# EAGLE design v1 (EAGLE 6.6.0)
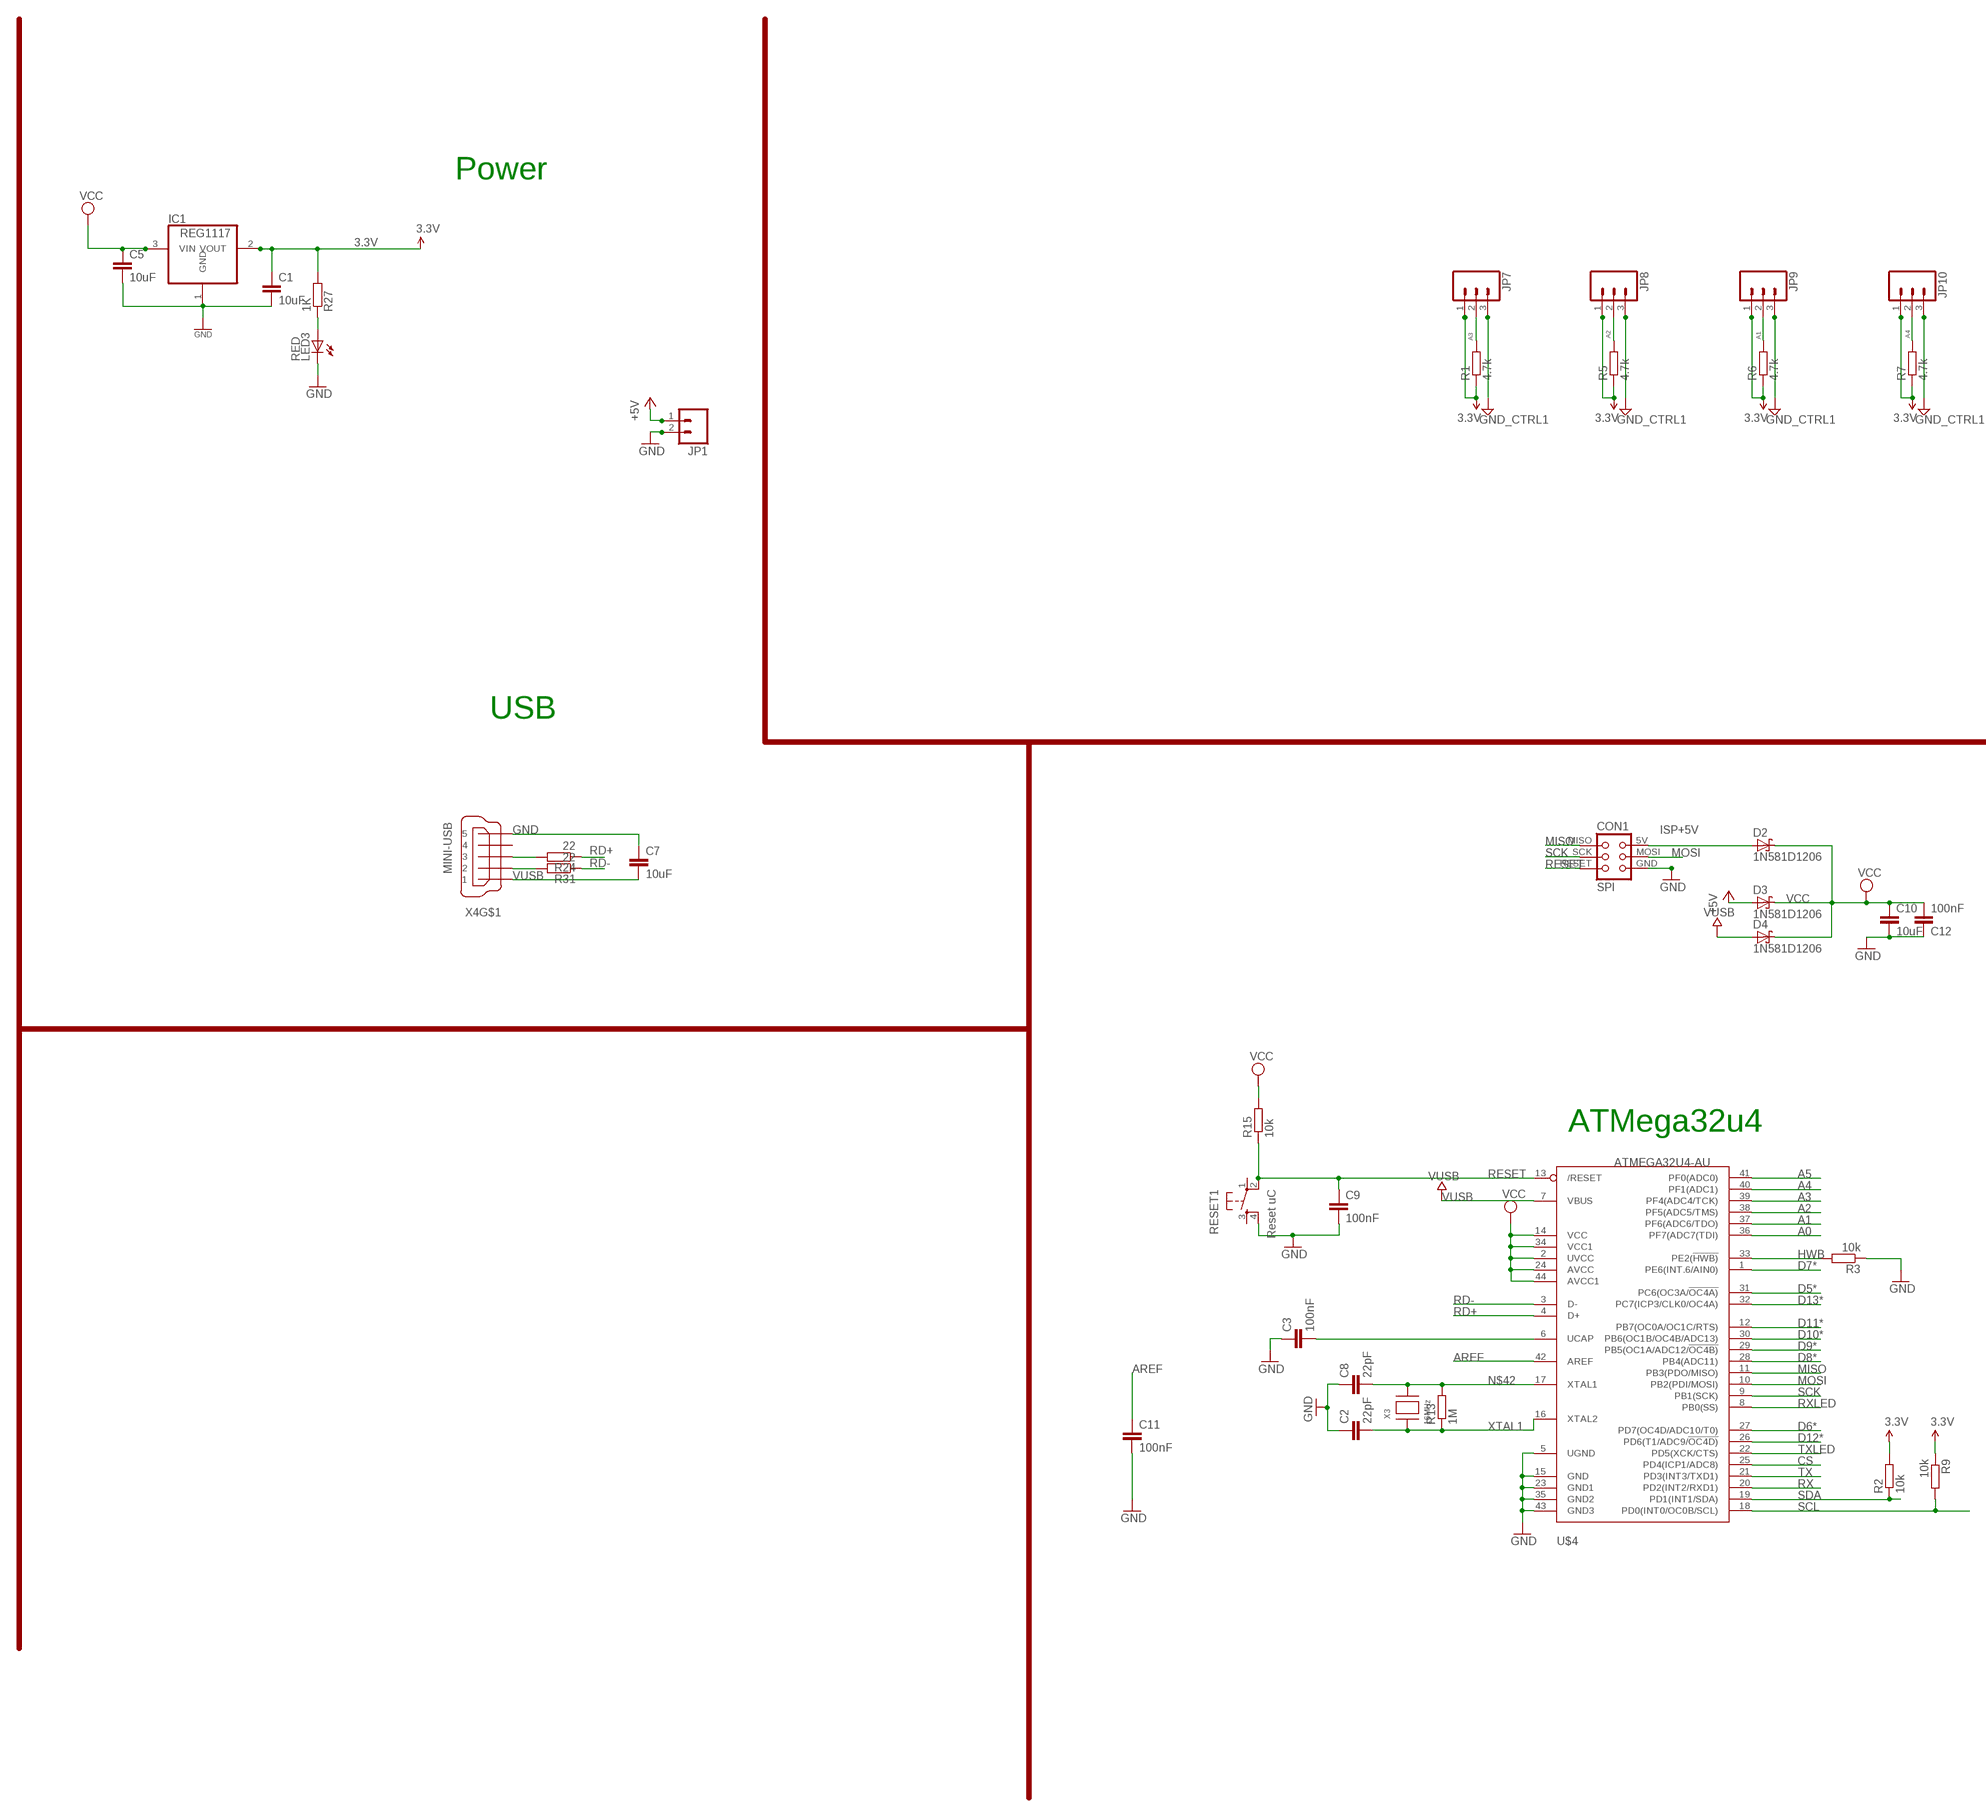
[diagram p0: schematic, sheet 1, part 1 of 2]
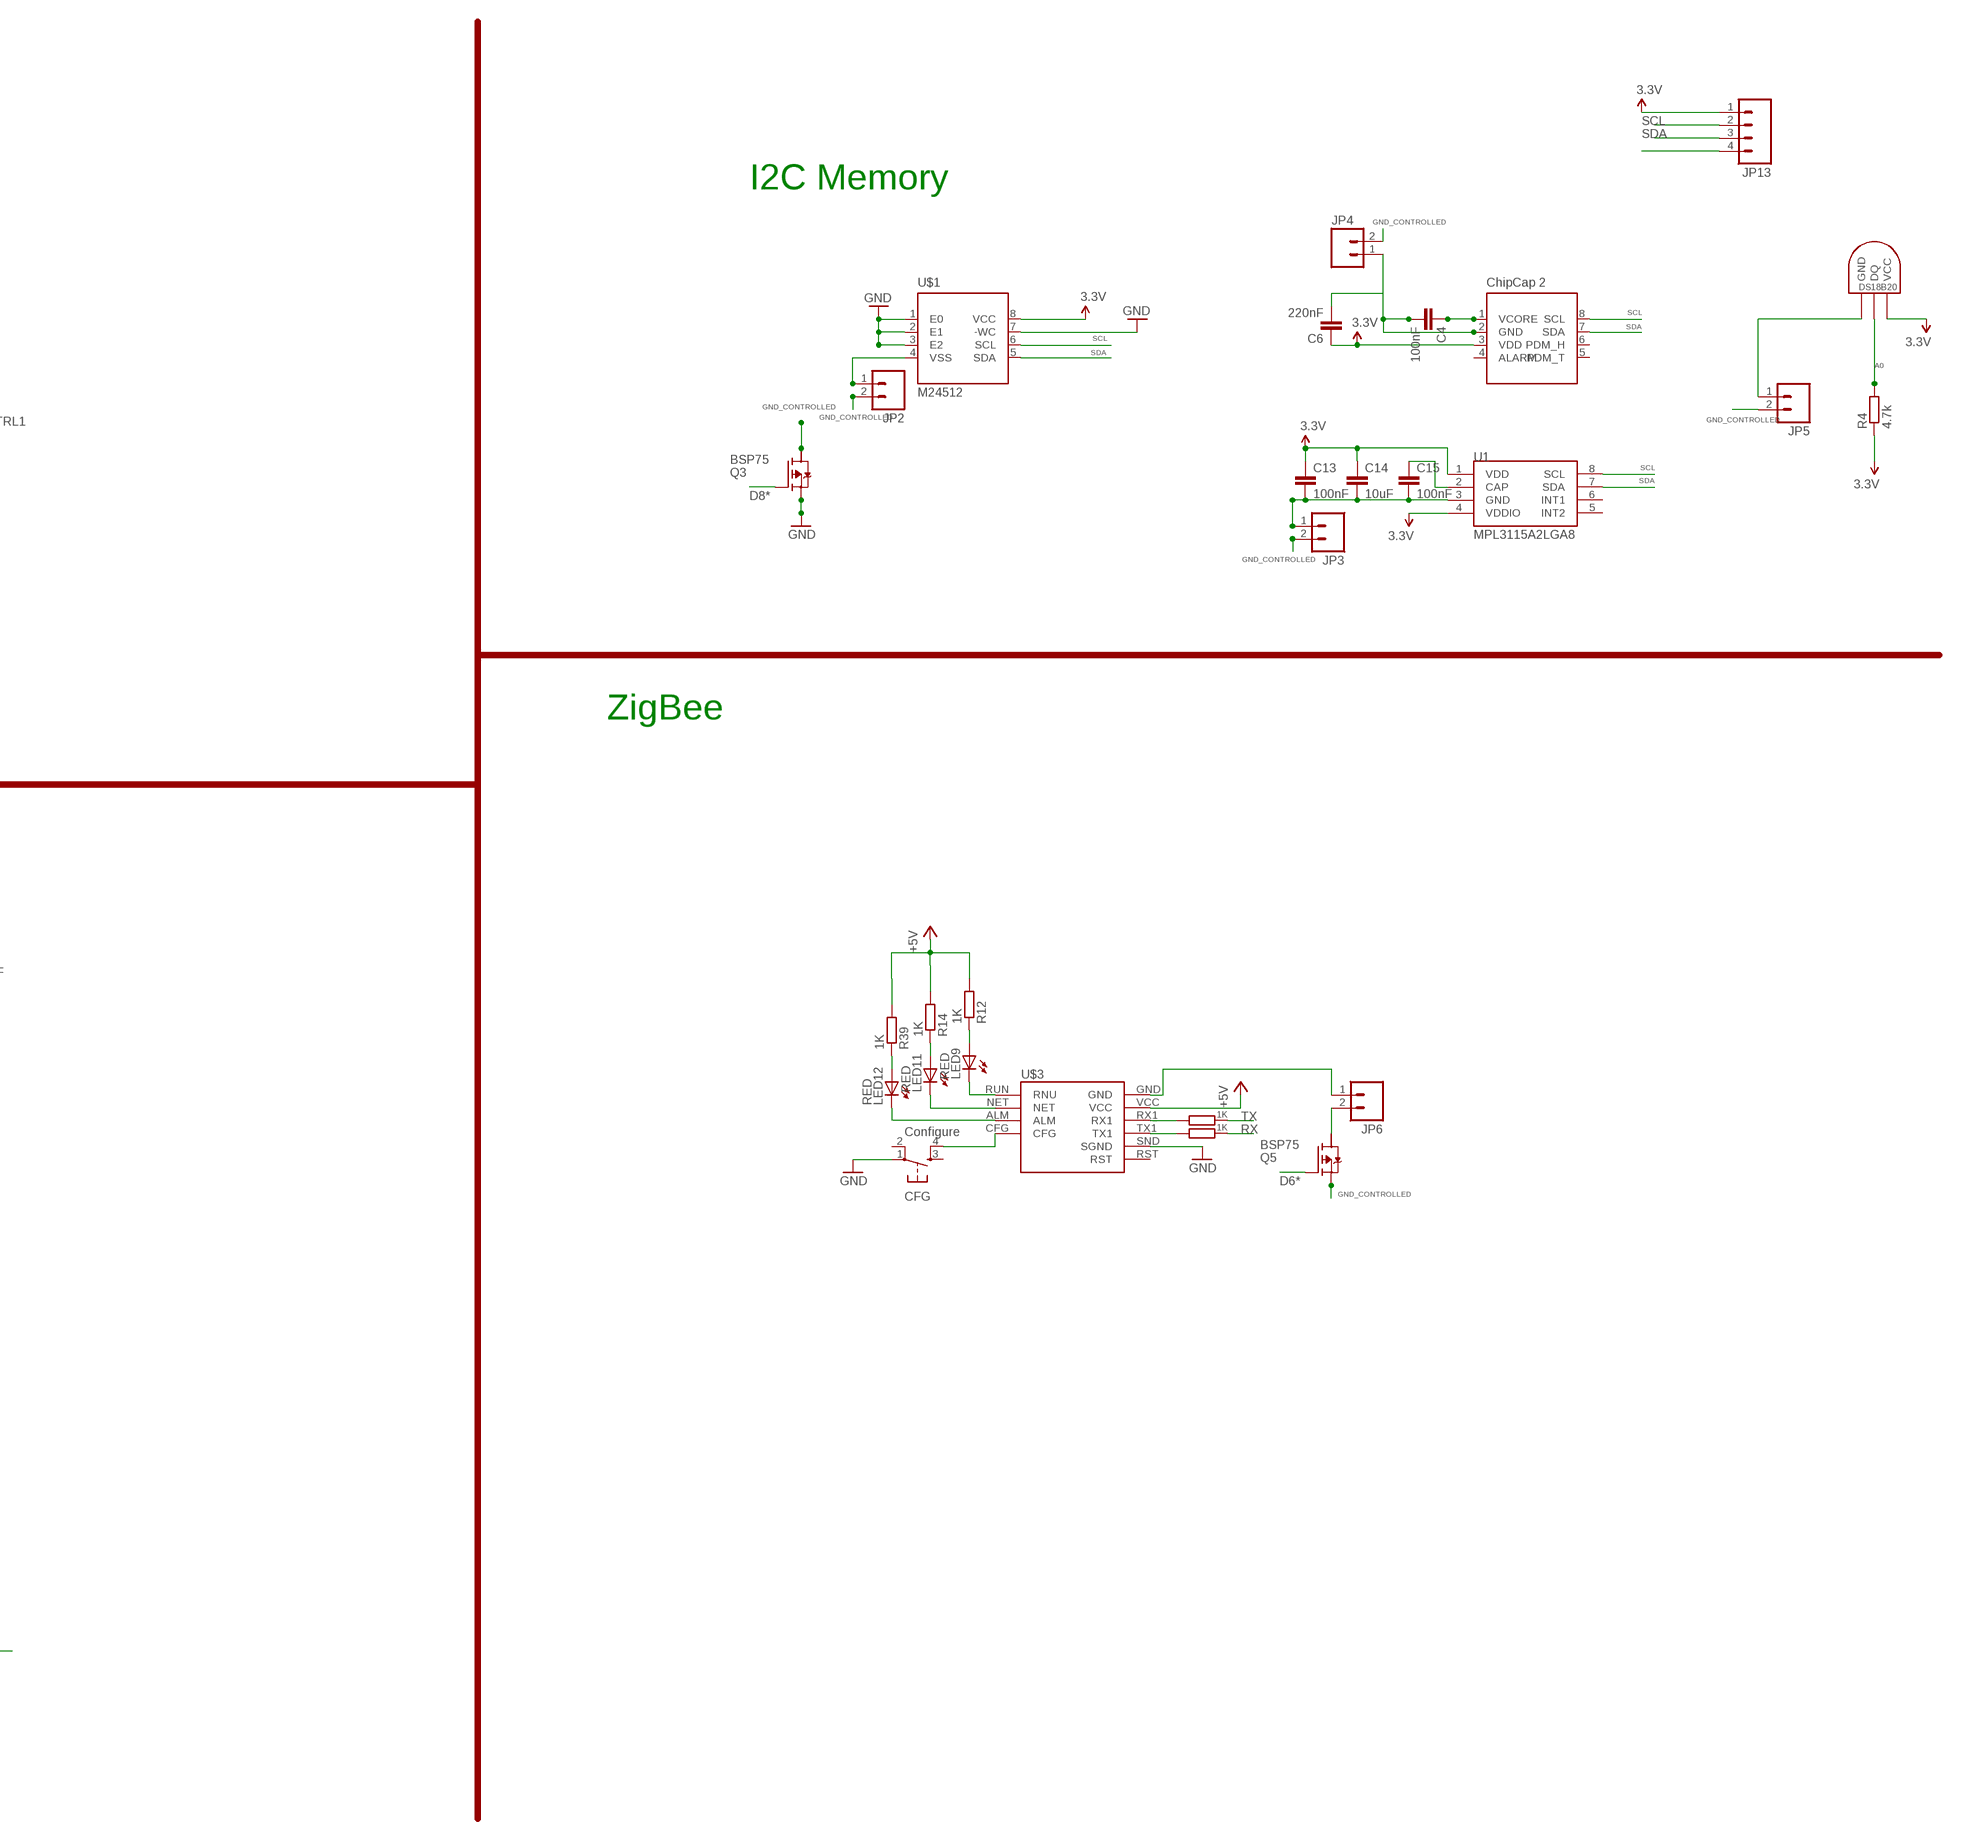
[diagram p1: schematic, sheet 1, part 2 of 2]

## Parts
C1  10uF  C-EUC1206  [C1206]
C2  22pF  C-EUC1206  [C1206]
C3  100nF  C-EUC1206  [C1206]
C4  100nF  C-EUC1206  [C1206]
C5  10uF  C-EUC1206  [C1206]
C6  220nF  C-EUC1206  [C1206]
C7  10uF  C-EUC1206  [C1206]
C8  22pF  C-EUC1206  [C1206]
C9  100nF  C-EUC1206  [C1206]
C10  10uF  C-EUC1206  [C1206]
C11  100nF  C-EUC1206  [C1206]
C12  100nF  C-EUC1206  [C1206]
C13  100nF  C-EUC1206  [C1206]
C14  10uF  C-EUC1206  [C1206]
C15  100nF  C-EUC1206  [C1206]
CFG  Configure  TAC_SWITCHSMD  [TACTILE_SWITCH_SMD]
CON1  SPI  TINYISPT  [TC2030-MCP-NL]
D2  1N581D1206  [LED-1206]
D3  1N581D1206  [LED-1206]
D4  1N581D1206  [LED-1206]
IC1  REG1117  [SOT223]
JP1  M02LOCK_LONGPADS  [1X02_LOCK_LONGPADS]
JP2  M02LOCK_LONGPADS  [1X02_LOCK_LONGPADS]
JP3  M02LOCK_LONGPADS  [1X02_LOCK_LONGPADS]
JP4  M02LOCK_LONGPADS  [1X02_LOCK_LONGPADS]
JP5  M02LOCK_LONGPADS  [1X02_LOCK_LONGPADS]
JP6  M02LOCK_LONGPADS  [1X02_LOCK_LONGPADS]
JP7  M03LONGPADS  [1X03_LONGPADS]
JP8  M03LONGPADS  [1X03_LONGPADS]
JP9  M03LONGPADS  [1X03_LONGPADS]
JP10  M03LONGPADS  [1X03_LONGPADS]
JP13  M04LOCK_LONGPADS  [1X04_LOCK_LONGPADS]
LED3  RED  LEDCHIP-LED0805  [CHIP-LED0805]
LED9  RED  LEDCHIP-LED0805  [CHIP-LED0805]
LED11  RED  LEDCHIP-LED0805  [CHIP-LED0805]
LED12  RED  LEDCHIP-LED0805  [CHIP-LED0805]
Q3  BSP75  BSP613P  [PG-SOT-223]
Q5  BSP75  BSP613P  [PG-SOT-223]
R1  4.7k  R-EU_M1206  [M1206]
R2  10k  R-EU_M1206  [M1206]
R3  10k  R-EU_M0805  [M0805]
R4  4.7k  R-EU_M1206  [M1206]
R5  4.7k  R-EU_M1206  [M1206]
R6  4.7k  R-EU_M1206  [M1206]
R7  4.7k  R-EU_M1206  [M1206]
R8  1K  R-EU_R0805  [R0805]
R9  10k  R-EU_M1206  [M1206]
R11  1K  R-EU_R0805  [R0805]
R12  1K  R-EU_R0805  [R0805]
R13  1M  R-EU_R1206  [R1206]
R14  1K  R-EU_R0805  [R0805]
R15  10k  R-EU_M0805  [M0805]
R24  22  R-EU_M1206  [M1206]
R27  1K  R-EU_R0805  [R0805]
R31  22  R-EU_M1206  [M1206]
R39  1K  R-EU_R0805  [R0805]
RESET1  Reset uC  TAC_SWITCHSMD  [TACTILE_SWITCH_SMD]
U1  MPL3115A2LGA8  [LGA8]
U$1  M24512  [SO8]
U$2  CHIPCAP  [CHIPCAP]
U$3  SZ05-ZIGBEETHROUGHHOLE  [SZ05-ZIGBEE4]
U$4  ATMEGA32U4-AU  [TQFP44]
U$6  DS1820  [µSOP8]
X3  16MHz  XTALNX6035  [NX6035]
X4  MINI-USB  MINI-USB-SCHIELD-32005-201  [32005-201]

## Nets
3.3V [power]: C1.1 C6.1 C13.1 C14.1 IC1.2(VOUT) JP7.1 JP8.1 JP9.1 JP10.1 JP13.1 R1.1 R2.2 R4.1 R5.1 R6.1 R7.1 R9.1 R27.2 U1.1(VDD) U1.4(VDDIO) U$1.8(VCC) U$2.3(VDD) U$6.8(VCC)
$1: C13.2 C14.2 C15.2 JP3.1 U1.3(GND)
$2: C4.2 C6.2 JP4.1 U$2.2(GND)
$3: JP5.1 U$6.4(GND)
$12: JP2.1 U$1.4(VSS)
+5V [power]: D3.A JP1.1 R12.2 R14.2 R39.2 U$3.VCC
A0: R4.2 U$4.36(PF7(ADC7(TDI)) U$6.1(DQ)
A1: JP9.2 R6.2 U$4.37(PF6(ADC6/TDO))
A2: JP8.2 R5.2 U$4.38(PF5(ADC5/TMS))
A3: JP7.2 R1.2 U$4.39(PF4(ADC4/TCK))
A4: JP10.2 R7.2 U$4.40(PF1(ADC1))
A5: U$4.41(PF0(ADC0))
AREF: C11.1 U$4.42(AREF)
CS: U$4.25(PD4(ICP1/ADC8))
D5*: U$4.31(PC6(OC3A/!OC4A))
D6*: Q5.1(G) U$4.27(PD7(OC4D/ADC10/T0))
D7*: U$4.1(PE6(INT.6/AIN0))
D8*: Q3.1(G) U$4.28(PB4(ADC11))
D9*: U$4.29(PB5(OC1A/ADC12/!OC4B))
D10*: U$4.30(PB6(OC1B/OC4B/ADC13))
D11*: U$4.12(PB7(OC0A/OC1C/RTS))
D12*: U$4.26(PD6(T1/ADC9/!OC4D))
D13*: U$4.32(PC7(ICP3/CLK0/OC4A))
D+USB: R24.2 X4.3
D-USB: R31.2 X4.2
GND [power]: C1.2 C2.1 C3.1 C5.2 C7.1 C8.1 C9.2 C10.2 C11.2 C12.1 CFG.1 CON1.GND IC1.1(GND) JP1.2 JP7.3 JP8.3 JP9.3 JP10.3 LED3.C Q3.3(S) R3.1 RESET1.4 U$1.1(E0) U$1.2(E1) U$1.3(E2) U$1.7(-WC) U$3.SND(SGND) U$4.5(UGND) U$4.15(GND) U$4.23(GND1) U$4.35(GND2) U$4.43(GND3) X4.5 ; supply symbol labelled GND_CTRL1
GND1 [VIN]: LED9.C U$3.RUN(RNU)
GND2 [VIN]: LED11.C U$3.NET
GND3 [VIN]: LED12.C U$3.ALM
GND_CONTROLLED [power]: JP2.2 JP3.2 JP4.2 JP5.2 JP13.4 Q3.2(D) Q5.3(S)
HWB: R3.2 U$4.33(PE2(!HWB))
ISP+5V: CON1.5V(VCC) D2.A
MISO: CON1.MISO U$4.11(PB3(PDO/MISO))
MOSI: CON1.MOSI U$4.10(PB2(PDI/MOSI))
N$2: JP6.2 Q5.2(D)
N$6: C4.1 U$2.1(VCORE)
N$8 [power]: JP6.1 U$3.GND
N$11: R11.2 U$3.RX1
N$13: C15.1 U1.2(CAP)
N$16: C3.2 U$4.6(UCAP)
N$20: LED3.A R27.1
N$24: R8.2 U$3.TX1
N$25: LED9.A R12.1
N$26: LED11.A R14.1
N$27: LED12.A R39.1
N$35: CFG.4 U$3.CFG
N$42: C8.2 R13.2 U$4.17(XTAL1) X3.P$2
RD+: R24.1 U$4.4(D+)
RD-: R31.1 U$4.3(D-)
RESET: C9.1 CON1.RESET R15.1 RESET1.2 U$4.13(/RESET)
RX: R8.1 U$4.20(PD2(INT2/RXD1))
RXLED: U$4.8(PB0(SS))
SCK: CON1.SCK U$4.9(PB1(SCK))
SCL: JP13.2 R9.2 U1.8(SCL) U$1.6(SCL) U$2.8(SCL) U$4.18(PD0(INT0/OC0B/SCL))
SDA: JP13.3 R2.1 U1.7(SDA) U$1.5(SDA) U$2.7(SDA) U$4.19(PD1(INT1/SDA))
TX: R11.1 U$4.21(PD3(INT3/TXD1))
TXLED: U$4.22(PD5(XCK/CTS))
VCC [fine]: C5.1 C10.1 C12.2 D2.C D3.C D4.C IC1.3(VIN) R15.2 U$4.2(UVCC) U$4.14(VCC) U$4.24(AVCC) U$4.34(VCC1) U$4.44(AVCC1)
VUSB: C7.2 D4.A U$4.7(VBUS) X4.1
XTAL1: C2.2 R13.1 U$4.16(XTAL2) X3.P$1
Unconnected: CFG.2 CFG.3 Q3.4(D) Q5.4(D) RESET1.1 RESET1.3 U1.5(INT2) U1.6(INT1) U$2.4(ALARM) U$2.5(PDM_T) U$2.6(PDM_H) U$3.RST X4.4 X4.M1(S:S1) X4.M2(S:S2) X4.M3(S:S3) X4.M4(S:S4)

## Notes on the sheet
- Power
- I2C Memory
- ZigBee
- USB
- ATMega32u4

## Library data of the parts
C1-C15 = rcl:C-EU: CAPACITOR, European symbol
CFG RESET1 = lpatiny:TAC_SWITCH: Momentary Switch Button commonly used for reset or general input. Spark Fun Electronics SKU : COM-00097
CON1 = lpatiny:TINYISP: CONNECTOR
D2-D4 = lpatiny:1N581*: 1.0A SCHOTTKY BARRIER RECTIFIER Source: http://www.diodes.com/datasheets/ds23001.pdf
IC1 = burr-brown:REG1117: 800mA and 1A Low Dropout (LDO) Positive Regulator 1.8V, 2.5V, 2.85V, 3.3V, 5V, and Adj; MPN: REG1117; OC_FARNELL: 1097566; OC_NEWARK: 14P6981
JP1-JP6 = SparkFun:M02: Header 2 Standard 2-pin 0.1" header. Use with straight break away headers (SKU : PRT-00116), right angle break away headers (PRT-00553), swiss pins (PRT-00743), machine pins (PRT-00117), and female headers (PRT-00115). Molex polarized connector foot print use with SKU : PRT-08233 with associated crimp pins and housings.
JP7-JP10 = SparkFun:M03: Header 3 Standard 3-pin 0.1" header. Use with straight break away headers (SKU : PRT-00116), right angle break away headers (PRT-00553), swiss pins (PRT-00743), machine pins (PRT-00117), and female headers (PRT-00115). Molex polarized connector foot print use with SKU : PRT-08232 with associated crimp pins and housings.
JP13 = SparkFun:M04: Header 4 Standard 4-pin 0.1" header. Use with straight break away headers (SKU : PRT-00116), right angle break away headers (PRT-00553), swiss pins (PRT-00743), machine pins (PRT-00117), and female headers (PRT-00115). Molex polarized connector foot print use with SKU : PRT-08231 with associated crimp pins and housings. 1MM SMD Version SKU: PRT-10208
LED3 LED9 LED11 LED12 = adafruit:LED: LED OSRAM: - CHIPLED LG R971, LG N971, LY N971, LG Q971, LY Q971, LO R971, LY R971 LH N974, LH R974 LS Q976, LO Q976, LY Q976 LO Q996 - Hyper CHIPLED LW Q18S LB Q993, LB Q99A, LB R99A - SideLED LS A670, LO A670, LY A670, LG A670, LP A670 LB A673, LV A673, LT A673, LW A673 LH A674 LY A675 LS A676, LA A676, LO A676, LY A676, LW A676 LS A679, LY A679, LG A679 - Hyper Micro SIDELED® LS Y876, LA Y876, LO Y876, LY Y876 LT Y87S - SmartLED LW L88C, LW L88S LB L89C, LB L89S, LG L890 LS L89K, LO L89K, LY L89K LS L896, LA L896, LO L896, LY L896 - TOPLED LS T670, LO T670, LY T670, LG T670, LP T670 LSG T670, LSP T670, LSY T670, LOP T670, LYG T670 LG T671, LOG T671, LSG T671 LB T673, LV T673, LT T673, LW T673 LH T674 LS T676, LA T676, LO T676, LY T676, LB T676, LH T676, LSB T676, LW T676 LB T67C, LV T67C, LT T67C, LS T67K, LO T67K, LY T67K, LW E67C LS E67B, LA E67B, LO E67B, LY E67B, LB E67C, LV E67C, LT E67C LW T67C LS T679, LY T679, LG T679 LS T770, LO T770, LY T770, LG T770, LP T770 LB T773, LV T773, LT T773, LW T773 LH T774 LS E675, LA E675, LY E675, LS T675 LS T776, LA T776, LO T776, LY T776, LB T776 LHGB T686 LT T68C, LB T68C - Hyper Mini TOPLED® LB M676 - Mini TOPLED Santana® LG M470 LS M47K, LO M47K, LY M47K Source: http://www.osram.convergy.de/
Q3 Q5 = infineon:BSP613P: SIPMOS (R) Small-Signal-Transistor P-Channel (2 Drain) Source: http://www.infineon.com/dgdl/BSP613P_Rev2.4.pdf; OC_FARNELL: unknown; OC_NEWARK: unknown
R1-R7 R9 R15 R24 R31 = resistor:R-EU_: RESISTOR, European symbol
R8 R11-R14 R27 R39 = rcl:R-EU_: RESISTOR, European symbol
U1 = SparkFun-Sensors:MPL3115A2: Altimeter/Pressure Sensor, I2C, 1.95V-3.6V supply, 50 to 110kPa
U$1 = lpatiny:M24512
U$2 = lpatiny:CHIPCAP
U$3 = lpatiny:SZ05-ZIGBEE
U$4 = adafruit:ATMEGA32U4: http://www.ladyada.net/library/eagle
U$6 = Ava:DS1820: DS18B20 Programmable Resolution 1-Wire Digital Thermometer Description The DS18B20 digital thermometer provides 9-bit to 12-bit Celsius temperature measurements and has an alarm function with nonvolatile user-programmable upper and lower trigger points. The DS18B20 communicates over a 1-Wire® bus that by definition requires only one data line (and ground) for communication with a central microprocessor. It has an operating temperature range of -55°C to +125°C and is accurate to ±0.5°C over the range of -10°C to +85°C. In addition, the DS18B20 can derive power directly from the data line ("parasite power"), eliminating the need for an external power supply. Each DS18B20 has a unique 64-bit serial code, which allows multiple DS18B20s to function on the same 1-Wire bus. Thus, it is simple to use one microprocessor to control many DS18B20s distributed over a large area. Applications that can benefit from this feature include HVAC environmental controls, temperature monitoring systems inside buildings, equipment, or machinery, and process monitoring and control systems.
X3 = lpatiny:XTAL: Low cost SMT crystals, no capacitors included http://www.ladyada.net/library/eagle
X4 = con-cypressindustries:MINI-USB-SCHIELD-: MINI USB-B Conector Source: www.cypressindustries.com; OC_FARNELL: unknown; OC_NEWARK: unknown

## Net classes
0 default: width 0.305 mm
1 power: width 0.61 mm
2 VIN: width 0.457 mm
3 fine: width 0.305 mm
4 aref: width 0.305 mm

## Board
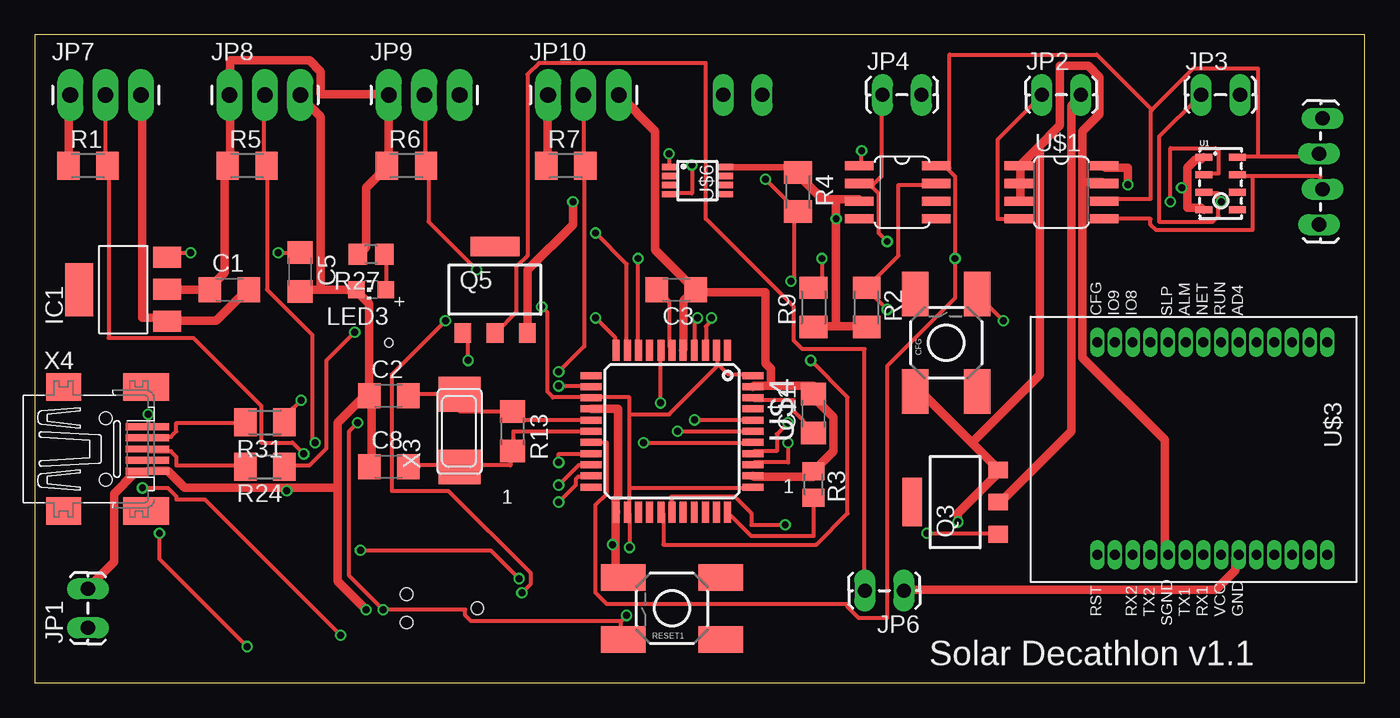
[diagram p2: board, top side]
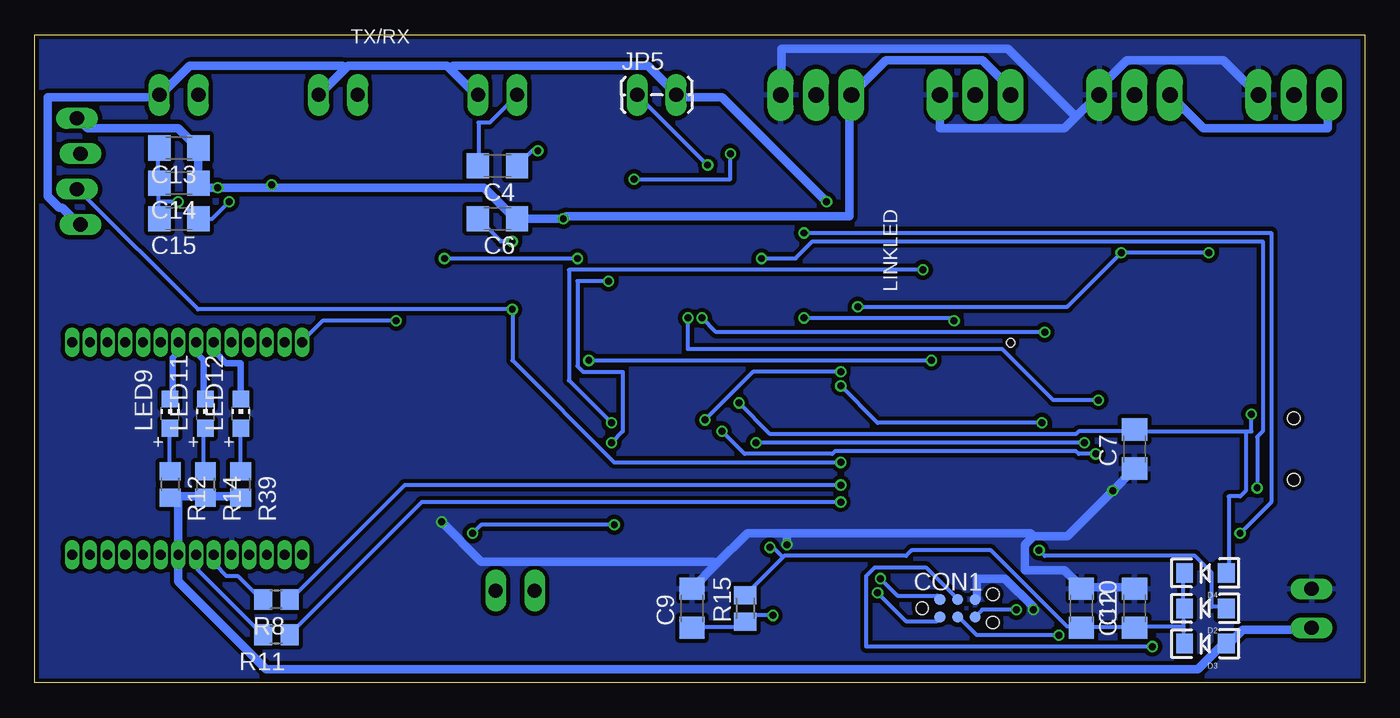
[diagram p3: board, bottom side, seen from below]

Size 95.43 x 46.47 mm. Coordinates in mm from the lower left corner, seen from the top.
Outline: 0,0 95.43,0 95.43,46.47 0,46.47 0,0
Copper layers (1*16): Top 0.035mm / dielectric 1.5mm / Bottom 0.035mm
Design rules "Fusion_eagle_rule_v1.1 *": minimum track width 6mil, minimum drill 0.5mm, track to track 7.5mil, track to pad 7.5mil, pad to pad 7.5mil, via to via 7.5mil, smd to smd 0mil, copper to edge 10mil, drill to drill 10mil, minimum pad ring 6mil, minimum via ring 6mil, stop-mask expansion 2mil, vias tented up to drill 100mil, thermal gap 10mil
Holes 0.6 mm at 25.4,24.38
bKeepout: area -1.3,57.4 to 114.3,85.3; area -7.6,54.9 to 108,82.8
vRestrict: area 38.1,20.6 to 53.3,25.7; area 38.1,10.4 to 53.3,15.5; area 48.3,10.4 to 53.3,25.7; area 38.1,10.4 to 43.2,25.7; area 25.4,1.5 to 34.3,9.1

### Footprints (pad centres in the part's own frame; a part is rotated, then mirrored left to right if it is on the bottom)
C1206 = smd 1.6 x 1.8: 1 -1.4,0; 2 1.4,0
TACTILE_SWITCH_SMD = smd 3.175 x 1.905: 1 -3.493,2.223; 2 3.493,2.223; 3 -3.493,-2.223; 4 3.493,-2.223
TC2030-MCP-NL = smd 0.787 x 0.787: 5V 1.27,0.635; GND 3.81,0.635; MISO 1.27,-0.635; MOSI 2.54,0.635; RESET 3.81,-0.635; SCK 2.54,-0.635 | hole 0.889: 0,0; 5.08,-1.016; 5.08,1.016
LED-1206 = smd 1.2 x 1.4: A -1.5,0; C 1.5,0
SOT223 = smd 1.499 x 2.007: 1 -2.261,-3.15; 2 0.025,-3.15; 3 2.311,-3.15 | smd 3.81 x 2.007: 4 0,3.15
1X02_LOCK_LONGPADS = drill 1.016 long: 1 -0.127,0; 2 2.667,0
1X03_LONGPADS = drill 1.118 pad 1.88 long: 1 0,0; 2 2.54,0; 3 5.08,0
1X04_LOCK_LONGPADS = drill 1.016 long: 1 0,0; 2 2.54,-0.254; 3 5.08,0; 4 7.62,-0.254
CHIP-LED0805 = smd 1.2 x 1.2: A 0,-1.05; C 0,1.05
PG-SOT-223 = smd 1.2 x 1.4: 1 -2.311,-3.099; 2 0,-3.099; 3 2.311,-3.099 | smd 3.5 x 1.4: 4 0,3.099
M1206 = smd 1.6 x 2: 1 -1.4,0; 2 1.4,0
M0805 = smd 1.3 x 1.6: 1 -0.95,0; 2 0.95,0
R0805 = smd 1.3 x 1.5: 1 -0.95,0; 2 0.95,0
R1206 = smd 1.6 x 1.803: 1 -1.422,0; 2 1.422,0
LGA8 = smd 1.2 x 0.5: 1 -1.2,1.875; 2 -1.2,0.625; 3 -1.2,-0.625; 4 -1.2,-1.875; 5 1.2,-1.875; 6 1.2,-0.625; 7 1.2,0.625; 8 1.2,1.875
SO8 = smd 0.66 x 2.032: 1 -3.81,-3.073; 2 -2.54,-3.073; 3 -1.27,-3.073; 4 0,-3.073; 5 0,3.073; 6 -1.27,3.073; 7 -2.54,3.073; 8 -3.81,3.073
CHIPCAP = smd 0.66 x 2.032: 1 -2.54,-3.073; 2 -1.27,-3.073; 3 0,-3.073; 4 1.27,-3.073; 5 1.27,2.438; 6 0,2.438; 7 -1.27,2.438; 8 -2.54,2.438
SZ05-ZIGBEE4 = drill 0.7 pad 1.016 long: AD1 -6.985,6.35; AD2 -6.985,5.08; AD3 -6.985,3.81; AD4 -6.985,2.54; ALM -6.985,-1.27; C485 -6.985,-3.81; CFG -6.985,-7.62; GND 8.255,2.54; IO1 -6.985,8.89; IO2 -6.985,7.62; IO3 8.255,8.89; IO4 8.255,7.62; IO5 8.255,6.35; IO6 8.255,5.08; IO7 8.255,3.81; IO8 -6.985,-5.08; IO9 -6.985,-6.35; MS 8.255,-6.35; NET -6.985,0; RST 8.255,-7.62; RUN -6.985,1.27; RX1 8.255,0; RX2 8.255,-5.08; SLD -6.985,-2.54; SND 8.255,-2.54; TX1 8.255,-1.27; TX2 8.255,-3.81; VCC 8.255,1.27
TQFP44 = smd 1.5 x 0.5: 1 -5.8,4; 2 -5.8,3.2; 3 -5.8,2.4; 4 -5.8,1.6; 5 -5.8,0.8; 6 -5.8,0; 7 -5.8,-0.8; 8 -5.8,-1.6; 9 -5.8,-2.4; 10 -5.8,-3.2; 11 -5.8,-4; 23 5.8,-4; 24 5.8,-3.2; 25 5.8,-2.4; 26 5.8,-1.6; 27 5.8,-0.8; 28 5.8,0; 29 5.8,0.8; 30 5.8,1.6; 31 5.8,2.4; 32 5.8,3.2; 33 5.8,4 | smd 0.5 x 1.5: 12 -4,-5.8; 13 -3.2,-5.8; 14 -2.4,-5.8; 15 -1.6,-5.8; 16 -0.8,-5.8; 17 0,-5.8; 18 0.8,-5.8; 19 1.6,-5.8; 20 2.4,-5.8; 21 3.2,-5.8; 22 4,-5.8; 34 4,5.8; 35 3.2,5.8; 36 2.4,5.8; 37 1.6,5.8; 38 0.8,5.8; 39 0,5.8; 40 -0.8,5.8; 41 -1.6,5.8; 42 -2.4,5.8; 43 -3.2,5.8; 44 -4,5.8
µSOP8 = smd 0.45 x 1: 1 -0.975,-2.05; 2 -0.325,-2.05; 3 0.325,-2.05; 4 0.975,-2.05; 5 0.975,2.05; 6 0.325,2.05; 7 -0.325,2.05; 8 -0.975,2.05
NX6035 = smd 2.5 x 3: P$1 2.665,0; P$2 -2.565,0
32005-201 = smd 3.1 x 0.5: 1 3,1.6; 2 3,0.8; 3 3,0; 4 3,-0.8; 5 3,-1.6 | smd 2.5 x 2: M1 -3,-4.45; M2 -3,4.45 | smd 3.3 x 2: M3 2.9,4.45; M4 2.9,-4.45 | hole 0.9: 0,2.2; 0,-2.2

### Placement (x,y rotation side)
C1  13.97,28.19 0 top
C2  25.4,20.57 0 top
C3  46.04,28.19 180 top
C4  62.23,37.08 180 bottom
C5  19.05,29.46 270 top
C6  62.23,33.27 180 bottom
C7  16.51,16.76 90 bottom
C8  25.4,15.49 0 top
C9  48.26,5.33 90 bottom
C10  16.51,5.33 90 bottom
C11  55.88,19.3 90 top
C12  20.32,5.33 270 bottom
C13  85.09,38.35 180 bottom
C14  85.09,35.81 180 bottom
C15  85.09,33.27 180 bottom
CFG  65.41,24.38 90 top
CON1  31.75,5.33 0 bottom
D2  11.43,5.33 180 bottom
D3  11.43,2.79 180 bottom
D4  11.43,7.87 180 bottom
IC1  6.35,28.19 90 top
JP1  3.81,4.06 90 top
JP2  72.39,42.16 0 top
JP3  83.82,42.16 0 top
JP4  60.96,42.16 0 top
JP5  52.07,42.16 0 bottom
JP6  62.23,6.6 180 top
JP7  2.54,42.16 0 top
JP8  13.97,42.16 0 top
JP9  25.4,42.16 0 top
JP10  36.83,42.16 0 top
JP13  92.41,40.49 270 top
LED3  24.13,28.19 90 top
LED9  85.72,19.3 0 bottom
LED11  83.19,19.3 0 bottom
LED12  80.64,19.3 0 bottom
Q3  66.04,12.95 90 top
Q5  33.02,28.19 0 top
R1  3.81,37.08 0 top
R2  59.69,26.92 270 top
R3  55.88,14.22 270 top
R4  54.76,35.2 270 top
R5  15.24,37.08 0 top
R6  26.67,37.08 0 top
R7  38.1,37.08 0 top
R8  78.11,5.97 180 bottom
R9  55.88,26.92 90 top
R11  78.11,3.43 180 bottom
R12  85.72,14.22 270 bottom
R13  34.29,18.03 270 top
R14  83.19,14.22 270 bottom
R15  44.45,5.33 90 bottom
R24  16.51,15.49 180 top
R27  24.13,30.73 180 top
R31  16.51,18.67 180 top
R39  80.64,14.22 270 bottom
RESET1  45.72,5.33 180 top
U1  85.09,35.81 0 top
U$1  73.66,33.27 270 top
U$2  62.23,34.54 270 top
U$3  83.86,17.44 270 top
U$4  45.72,18.03 270 top
U$6  47.55,36.02 270 top
X3  30.48,18.03 90 top
X4  5.08,16.76 0 top

### Tracks (layer width: path | path; a pad name or v marks a point on that pad's centre or on a via)
3.3V  (via drill 0.5)
  Top 0.457: 54.66,37.13 54.52,36.99 U$6.8
  Top 0.61: R7.1 36.78,37.13 36.78,42.01 JP10.1 | R27.2 23.37,30.84 23.77,31.24 23.77,35.51 25.2,36.93 R6.1 25.4,37.34 JP9.1 25.2,42.21 20.52,42.21 20.52,43.84 19.71,44.65 14.02,44.65 14.02,42.42 JP8.1 14.02,42.01 14.02,37.13 R5.1 13.61,36.93 13.61,29.41 12.6,28.4 C1.1 9.55,28.19 IC1.2 | R1.1 2.44,37.13 2.44,42.01 JP7.1 | 57.51,25.55 59.54,25.55 R2.2 | 57.51,25.55 55.88,25.55 R9.1 | 54.66,37.13 54.66,36.73 R4.1 54.86,36.32 56.29,34.9 56.29,34.7 57.51,34.7 | 57.51,34.7 59.13,34.7 U$2.3 | 57.51,34.7 v57.51,33.27 57.51,25.55 | 82.7,35.51 82.7,36.93 83.31,37.54 83.72,37.54 U1.1 | 82.7,35.51 82.7,34.09 83.72,34.09 U1.4 | v78.44,35.71 78.44,36.93 76.81,36.93 U$1.8 | v82.3,35.51 82.7,35.51
  Bottom 0.61: JP9.1 25.4,42.62 27.43,44.65 34.34,44.65 JP10.1 36.98,42.01 36.98,33.48 57.3,33.48 v57.51,33.27 C6.1 60.96,33.27 63.2,35.51 78.44,35.51 | JP8.1 11.58,39.78 2.64,39.78 2.64,42.01 JP7.1 | 78.44,35.51 v82.3,35.51 83.31,35.51 83.52,35.71 C14.1 83.72,36.12 83.72,38.35 C13.1 83.92,38.56 85.14,39.78 91.64,39.78 92.25,40.39 JP13.1 | v78.44,35.71 78.44,35.51
$1  (via drill 0.5)
  Top 0.305: 84.94,34.49 84.94,33.48 84.53,33.07 80.67,33.07 80.67,39.17 83.52,42.01 JP3.1 | 84.94,34.49 84.94,35.1 83.92,35.1 U1.3 | 84.94,34.49 v85.14,34.49
  Bottom 0.305: 86.56,34.49 86.56,35.71 C14.2 86.56,35.92 86.56,38.35 C13.2 | 86.56,34.49 86.56,33.27 C15.2 | v85.14,34.49 86.56,34.49
$2  (via drill 0.5)
  Top 0.305: v61.16,31.65 60.55,32.26 60.55,35.1 59.94,35.71 59.33,35.71 U$2.2 60.15,35.71 60.76,36.32 60.76,42.01 JP4.1
  Bottom 0.305: v61.16,31.65 61.98,31.65 63.6,33.27 C6.2 | C4.2 63.6,37.13 63.6,40.18 62.79,40.18 60.96,42.01 JP4.1
$3  (via drill 0.5)
  Top 0.305: v47.14,37.13 47.14,35.1 45.52,35.1 U$6.4
  Bottom 0.305: v47.14,37.13 52.02,42.01 JP5.1
$12
  Top 0.305: U$1.4 69.09,33.27 69.09,38.96 72.14,42.01 JP2.1
+5V
  Bottom 0.61: JP1.1 3.86,3.81 8.74,3.81 9.75,2.79 D3.A 10.16,2.79 11.99,0.97 78.84,0.97 85.14,7.26 85.14,8.89 U$3.VCC 85.14,9.3 85.14,13.16 R12.2 85.55,13.36 83.31,13.36 R14.2 83.11,13.36 80.67,13.36 R39.2
A0  (via drill 0.5)
  Top 0.305: v45.52,37.95 45.52,37.13 U$6.1 | v52.43,36.12 54.66,33.88 R4.2 54.46,33.88 54.46,29.01 v54.25,28.8 | v54.05,17.22 54.05,15.8 51.61,15.8 U$4.36
  Bottom 0.305: v45.52,37.95 45.52,36.12 v52.43,36.12 | v54.05,17.22 53.24,18.03 53.24,22.3 56.08,22.3 56.49,22.71 56.49,28.8 v54.25,28.8
A1  (via drill 0.5)
  Top 0.305: v54.05,18.64 53.24,17.83 53.24,16.61 51.61,16.61 U$4.37 | v31.7,29.62 28.25,33.07 28.25,36.93 R6.2 28.04,37.13 28.04,42.01 JP9.2
  Bottom 0.305: v54.05,18.64 57.1,21.69 57.1,29.62 v31.7,29.62
A2  (via drill 0.5)
  Top 0.305: v43.69,17.22 51.41,17.22 U$4.38 | v20.12,17.22 19.91,17.42 19.91,24.94 16.66,28.19 16.66,36.93 R5.2 16.46,37.13 16.46,42.01 JP8.2
  Bottom 0.305: v20.12,17.22 v43.69,17.22
A3  (via drill 0.5)
  Top 0.305: v46.13,18.03 U$4.39 | v19.3,16.41 18.49,17.22 16.26,17.22 16.26,19.86 11.38,24.74 5.28,24.74 5.28,36.93 R1.2 5.08,37.13 JP7.2
  Bottom 0.305: v46.13,18.03 44.5,16.41 38.2,16.41 38,16.61 20.73,16.61 20.52,16.41 v19.3,16.41
A4  (via drill 0.5)
  Top 0.305: v47.35,18.85 51.41,18.85 U$4.40 | v37.59,22.3 39.42,24.13 39.42,36.93 R7.2 39.42,37.13 39.42,42.01 JP10.2
  Bottom 0.305: v47.35,18.85 43.89,22.3 v37.59,22.3
AREF
  Top 0.305: U$4.42 51.61,20.27 54.46,20.27 54.46,19.46 55.88,18.03 C11.1
D6*  (via drill 0.5)
  Top 0.305: v31.09,23.11 31.09,24.74 30.89,24.94 Q5.1 | v55.68,23.11 58.32,20.47 58.32,12.14 56.08,9.91 45.11,9.91 45.11,12.14 U$4.27
  Bottom 0.305: v55.68,23.11 v31.09,23.11
D8*  (via drill 0.5)
  Top 0.305: v64.01,10.72 69.09,10.72 Q3.1 | v53.85,11.33 51.41,11.33 51.41,12.14 50.19,13.36 45.72,13.36 U$4.28
  Bottom 0.305: v64.01,10.72 63.4,11.33 v53.85,11.33
D+USB
  Top 0.305: R24.2 15.04,15.6 10.16,15.6 10.16,16.2 9.75,16.61 8.13,16.61 X4.3
D-USB
  Top 0.305: R31.2 15.04,18.64 10.16,18.64 10.16,18.03 9.75,17.63 8.13,17.63 X4.2
GND  (via drill 0.5)
  Top 0.61: 67.26,17.22 63.6,20.88 63.2,20.88 CFG.1 | 67.26,17.22 69.09,15.39 Q3.3 69.09,14.99 66.24,12.14 v66.24,11.53 | U$1.3 70.71,34.7 70.71,35.71 U$1.2 70.71,35.92 70.71,36.93 U$1.1 70.71,37.13 71.93,38.35 | 75.18,35.92 76.61,35.92 U$1.7 | 75.18,35.92 75.18,39.57 76.4,40.79 76.4,43.43 75.59,44.25 73.56,44.25 73.56,39.98 71.93,38.35 | 75.18,35.92 75.18,23.32 81.08,17.42 81.08,9.5 81.28,9.3 U$3.SND | 67.26,17.22 72.14,22.1 72.14,38.15 71.93,38.35 | 41.66,9.91 41.66,8.08 42.06,7.67 RESET1.4 | 41.66,9.91 41.66,12.14 U$4.23 41.66,12.34 41.66,13.16 41.86,13.36 41.86,19.66 40.03,19.66 U$4.15 | v41.45,9.91 41.66,9.91 | U$4.5 46.53,23.93 46.53,27.38 47.35,28.19 C3.1 | U$4.35 51.61,14.78 55.88,14.78 R3.1 56.08,15.39 57.3,16.61 57.3,19.05 55.88,20.47 C11.2 55.88,21.29 52.83,21.29 | 52.83,21.29 51.61,21.29 U$4.43 | 52.83,21.29 52.83,22.5 52.43,22.91 52.43,27.99 47.55,27.99 C3.1 | JP10.3 44.5,39.57 44.5,31.04 47.14,28.4 C3.1 | JP1.2 3.86,6.86 5.69,8.69 5.69,13.56 7.11,14.99 7.92,14.99 X4.5 8.33,15.19 9.55,15.19 10.77,13.97 18.09,13.97 | 20.52,28.19 19.1,28.19 C5.2 | 20.52,28.19 LED3.C 23.16,27.99 23.98,27.18 23.98,20.88 C2.1 | C8.1 24.18,15.6 24.18,20.47 C2.1 | 21.74,13.97 18.09,13.97 | 21.74,13.97 21.74,18.64 23.77,20.68 C2.1 | C1.2 15.24,28.19 13.01,25.96 9.55,25.96 IC1.1 9.35,26.16 7.72,26.16 7.72,42.01 JP7.3 | 20.52,28.19 20.52,40.59 19.1,42.01 JP8.3 | v18.09,13.77 18.09,13.97 | v23.77,5.23 21.74,7.26 21.74,13.97
  Bottom 0.61: C10.2 16.66,6.86 20.32,6.86 C12.1 20.52,7.06 21.54,8.08 24.38,8.08 24.38,9.91 23.77,10.52 | 23.77,10.52 21.34,10.52 v18.09,13.77 16.66,15.19 C7.1 | 46.53,8.48 44.3,10.72 41.45,10.72 | 46.53,8.48 48.16,6.86 C9.2 | 41.45,10.72 23.98,10.72 23.77,10.52 | 41.45,10.72 v41.45,9.91 | JP7.3 7.72,42.21 10.16,44.65 17.07,44.65 18.9,42.82 18.9,42.21 JP8.3 19.3,42.01 20.73,40.59 | JP9.3 30.48,39.78 21.54,39.78 20.73,40.59 | 20.73,40.59 25.6,45.47 41.86,45.47 41.86,42.21 JP10.3 | v66.24,11.53 63.4,8.69 46.74,8.69 46.53,8.48 | v23.77,5.23 23.77,5.44 25.81,7.47 27.84,7.47 27.84,6.04 CON1.GND
  pour Bottom (isolate 0.305): 0.1,46.58 95.5,46.58 95.5,-0.05 0.1,-0.05 0.1,46.08
GND1
  Bottom 0.457: LED9.C 85.55,20.47 85.55,23.32 85.14,23.72 85.14,24.33 U$3.RUN
GND2
  Bottom 0.457: LED11.C 83.31,20.47 83.31,23.11 83.72,23.52 83.72,24.33 U$3.NET
GND3
  Bottom 0.457: LED12.C 80.67,20.47 80.67,22.91 81.69,22.91 82.5,23.72 82.5,24.33 U$3.ALM
GND_CONTROLLED  (via drill 0.5)
  Top 0.61: v38.61,34.49 38.61,32.87 35.36,29.62 35.36,25.15 Q5.3 | Q3.2 69.29,12.95 74.37,18.03 74.37,41.4 74.98,42.01 JP2.2
  Bottom 0.61: v38.61,34.49 46.13,42.01 49.38,42.01 JP5.2 49.58,42.42 51.41,44.25 65.43,44.25 65.63,44.04 | 65.63,44.04 65.84,44.25 72.95,44.25 73.15,44.04 | 65.63,44.04 63.8,42.21 JP4.2 | 73.15,44.04 74.98,42.21 JP2.2 | 73.15,44.04 73.36,44.25 84.33,44.25 86.36,42.21 JP3.2 86.56,42.01 94.49,42.01 94.49,34.9 93.67,34.09 93.47,34.09 92.25,32.87 JP13.4
HWB
  Top 0.305: R3.2 55.88,10.52 51.41,10.52 49.78,12.14 U$4.33
ISP+5V  (via drill 0.5)
  Top 0.305: v34.75,7.47 32.72,9.5 v23.37,9.5
  Bottom 0.305: v34.75,7.47 33.53,6.25 30.68,6.25 30.48,6.04 CON1.5V | v23.37,9.5 22.96,9.09 12.19,9.09 10.97,7.87 10.97,5.44 9.96,5.44 D2.A
MISO  (via drill 0.5)
  Top 0.305: v34.95,6.45 35.56,7.06 35.56,7.87 29.67,13.77 25.6,13.77 25.6,22.1 v29.46,25.96 | v40.23,26.16 41.66,24.74 41.66,23.93 U$4.11
  Bottom 0.305: v34.95,6.45 32.92,4.42 30.68,4.42 30.48,4.62 CON1.MISO | v29.46,25.96 29.67,26.16 v40.23,26.16
MOSI  (via drill 0.5)
  Top 0.305: v15.24,2.59 8.94,8.89 v8.94,10.72 | v40.23,32.26 42.47,30.02 42.47,23.93 U$4.10
  Bottom 0.305: v15.24,2.59 35.76,2.59 35.76,7.67 35.15,8.28 31.5,8.28 29.26,6.04 CON1.MOSI | v8.94,10.72 6.71,12.95 6.71,32.26 v40.23,32.26
N$2
  Top 0.305: Q5.2 33.12,25.15 34.54,26.57 34.54,29.82 35.36,30.63 35.36,43.64 36.17,44.45 48.16,44.45 48.16,33.27 54.46,26.98 54.46,24.54 55.07,23.93 59.54,23.93 59.54,6.66 JP6.2
N$6  (via drill 0.5)
  Top 0.305: v59.33,38.15 59.33,37.13 U$2.1
  Bottom 0.305: v59.33,38.15 59.74,38.15 60.76,37.13 C4.1
N$8
  Top 0.61: U$3.GND 86.36,9.09 86.16,8.89 86.16,8.08 84.73,6.66 62.38,6.66 JP6.1
N$11
  Bottom 0.305: R11.2 79.25,3.61 83.72,8.08 83.72,9.09 U$3.RX1
N$13  (via drill 0.5)
  Top 0.305: v81.48,34.49 81.48,38.35 84.73,38.35 84.94,38.15 84.94,36.52 83.92,36.52 U1.2
  Bottom 0.305: v81.48,34.49 82.7,33.27 C15.1
N$16
  Top 0.305: U$4.6 45.72,23.93 45.52,24.13 45.52,27.38 44.7,28.19 C3.2
N$20
  Top 0.305: LED3.A 25.2,28.19 25.2,30.63 R27.1
N$24
  Bottom 0.305: R8.2 79.25,6.04 80.87,7.67 81.69,7.67 82.5,8.48 82.5,9.09 U$3.TX1
N$25
  Bottom 0.305: LED9.A 85.75,18.24 85.75,15.19 R12.1
N$26
  Bottom 0.305: LED11.A 83.31,18.24 83.31,15.19 R14.1
N$27
  Bottom 0.305: LED12.A 80.67,18.24 80.67,15.19 R39.1
N$35  (via drill 0.5)
  Top 0.305: v69.49,25.96 67.67,27.79 CFG.4
  Bottom 0.305: v69.49,25.96 74.78,25.96 76.2,24.54 U$3.CFG
N$42
  Top 0.305: 30.48,15.6 26.82,15.6 C8.2 | U$4.17 34.34,18.03 34.34,16.82 R13.2 34.14,16.61 34.14,15.6 30.48,15.6 | 30.48,15.6 X3.P$2
RD+  (via drill 0.5)
  Top 0.305: v47.55,26.16 47.35,25.96 47.35,23.93 U$4.4 | v22.96,25.15 20.93,23.11 20.93,16.82 19.71,15.6 18.09,15.6 R24.1
  Bottom 0.305: v47.55,26.16 46.53,25.15 v22.96,25.15
RD-  (via drill 0.5)
  Top 0.305: v48.56,26.16 48.56,25.96 48.16,25.55 48.16,23.93 U$4.3 | v19.1,20.27 18.09,19.25 18.09,18.85 R31.1
  Bottom 0.305: v48.56,26.16 48.56,23.93 26.01,23.93 22.35,20.27 v19.1,20.27
RESET  (via drill 0.5)
  Top 0.305: 42.06,4.42 31.29,4.42 30.89,4.83 30.89,5.23 v24.99,5.23 22.55,7.67 22.55,18.03 v23.16,18.64 | 42.06,4.42 42.06,3.2 RESET1.2 | v37.59,21.29 39.83,21.29 U$4.13 | 42.06,4.42 v42.47,4.83
  Bottom 0.305: C9.1 48.16,4.01 44.7,4.01 44.5,4.22 R15.1 44.3,4.42 43.89,4.83 v42.47,4.83 | v24.99,5.23 27.43,5.23 27.84,4.83 CON1.RESET | v37.59,21.29 34.95,18.64 v23.16,18.64
RX  (via drill 0.5)
  Top 0.305: v37.59,14.17 39.01,15.6 39.83,15.6 U$4.20
  Bottom 0.305: v37.59,14.17 68.89,14.17 77.01,6.04 R8.1
SCK  (via drill 0.5)
  Top 0.305: v21.95,3.4 12.19,13.16 10.16,13.16 10.16,13.36 9.55,13.97 v7.72,13.97 | v43.28,30.43 43.28,23.93 U$4.9
  Bottom 0.305: v21.95,3.4 27.84,3.4 29.06,4.62 CON1.SCK | v7.72,13.97 7.72,17.63 7.32,18.03 7.32,31.65 39.62,31.65 40.84,30.43 v43.28,30.43
SCL  (via drill 0.5)
  Top 0.305: 87.78,37.74 92.05,37.74 92.05,37.95 JP13.2 | 87.78,37.74 86.36,37.74 U1.8 | 80.16,41.1 83.11,44.04 87.78,44.04 87.78,37.74 | 80.16,41.1 80.06,41 80.06,34.7 76.81,34.7 U$1.6 | U$4.18 40.03,17.22 41.05,17.22 41.05,13.56 40.23,12.75 40.23,6.45 41.05,5.64 58.32,5.64 58.32,5.44 59.13,4.62 61.16,4.62 61.16,22.71 66.04,27.58 v66.04,30.43 66.04,36.32 65.43,36.93 64.82,36.93 U$2.8 65.63,36.93 65.63,45.06 76.2,45.06 80.16,41.1 | v56.49,30.43 56.49,29.01 55.88,28.4 R9.2
  Bottom 0.305: v66.04,30.43 v56.49,30.43
SDA  (via drill 0.5)
  Top 0.305: 87.38,36.32 92.25,36.32 92.25,35.51 JP13.3 | 87.38,36.32 86.36,36.32 U1.7 | U$1.5 80.06,33.27 80.06,32.87 80.47,32.46 87.38,32.46 87.38,36.32 | v37.59,15.8 37.59,16.41 39.83,16.41 U$4.19 | v61.16,26.77 59.74,28.19 R2.1 59.74,28.4 61.98,30.63 61.98,35.71 64.62,35.71 U$2.7
  Bottom 0.305: v37.59,15.8 53.85,15.8 61.16,23.11 v61.16,26.77 83.72,26.77 92.25,35.31 JP13.3
TX  (via drill 0.5)
  Top 0.305: v37.59,12.95 38.81,14.17 38.81,14.58 39.01,14.78 39.83,14.78 U$4.21
  Bottom 0.305: v37.59,12.95 67.67,12.95 77.01,3.61 R11.1
VCC  (via drill 0.5)
  Top 0.305: v17.48,30.84 18.9,30.84 C5.1 | v11.18,30.84 9.55,30.84 9.55,30.63 IC1.3 | 49.07,22.81 49.78,22.1 51.41,22.1 U$4.44 | 49.07,22.81 48.97,22.91 48.97,23.72 U$4.2 | 42.67,13.97 42.67,12.34 U$4.24 42.67,12.14 v42.67,9.7 | 42.67,13.97 42.67,19.25 | 42.67,19.25 42.67,20.47 40.03,20.47 U$4.14 39.83,20.47 37.19,20.47 36.78,20.88 36.78,26.57 v36.37,26.98 | 42.67,13.97 51.41,13.97 U$4.34 | 49.07,22.81 45.52,19.25 42.67,19.25
  Bottom 0.305: 13.01,4.01 13.01,5.23 D2.C 13.01,5.44 13.01,7.87 D4.C | 13.01,4.01 13.01,2.79 D3.C | 13.01,4.01 16.46,4.01 C10.1 16.66,4.01 20.32,4.01 | 41.76,8.99 41.66,9.09 32.92,9.09 32.51,9.5 26.82,9.5 21.34,4.01 20.32,4.01 | 41.76,8.99 44.3,6.45 R15.2 | 20.32,4.01 C12.2 | v11.18,30.84 v17.48,30.84 21.34,26.98 v36.37,26.98 | 41.76,8.99 42.47,9.7 v42.67,9.7
VUSB  (via drill 0.5)
  Top 0.305: v44.91,20.07 44.91,23.72 U$4.7 | v8.13,19.25 8.13,18.44 X4.1
  Bottom 0.305: 8.53,18.03 8.53,13.77 8.94,13.36 9.75,13.36 9.75,7.87 D4.A | 8.53,18.03 16.46,18.03 C7.2 16.66,18.03 20.52,18.03 20.73,17.83 42.67,17.83 v44.91,20.07 | v8.13,19.25 8.13,18.03 8.53,18.03
XTAL1
  Top 0.305: U$4.16 39.83,18.85 34.34,18.85 34.34,19.25 R13.1 34.14,19.46 30.48,19.46 30.48,20.68 | 30.48,20.68 26.82,20.68 C2.2 | 30.48,20.68 X3.P$1

### Text on the board
tNames: 1 | 1 | Solar Decathlon v1.1
bNames: USB | TX/RX | LINKLED
tValues: GND_CTRL SDA SCL 3.3V
203bmp: C:/Users/G/Pictures/logo_epfl.bmp